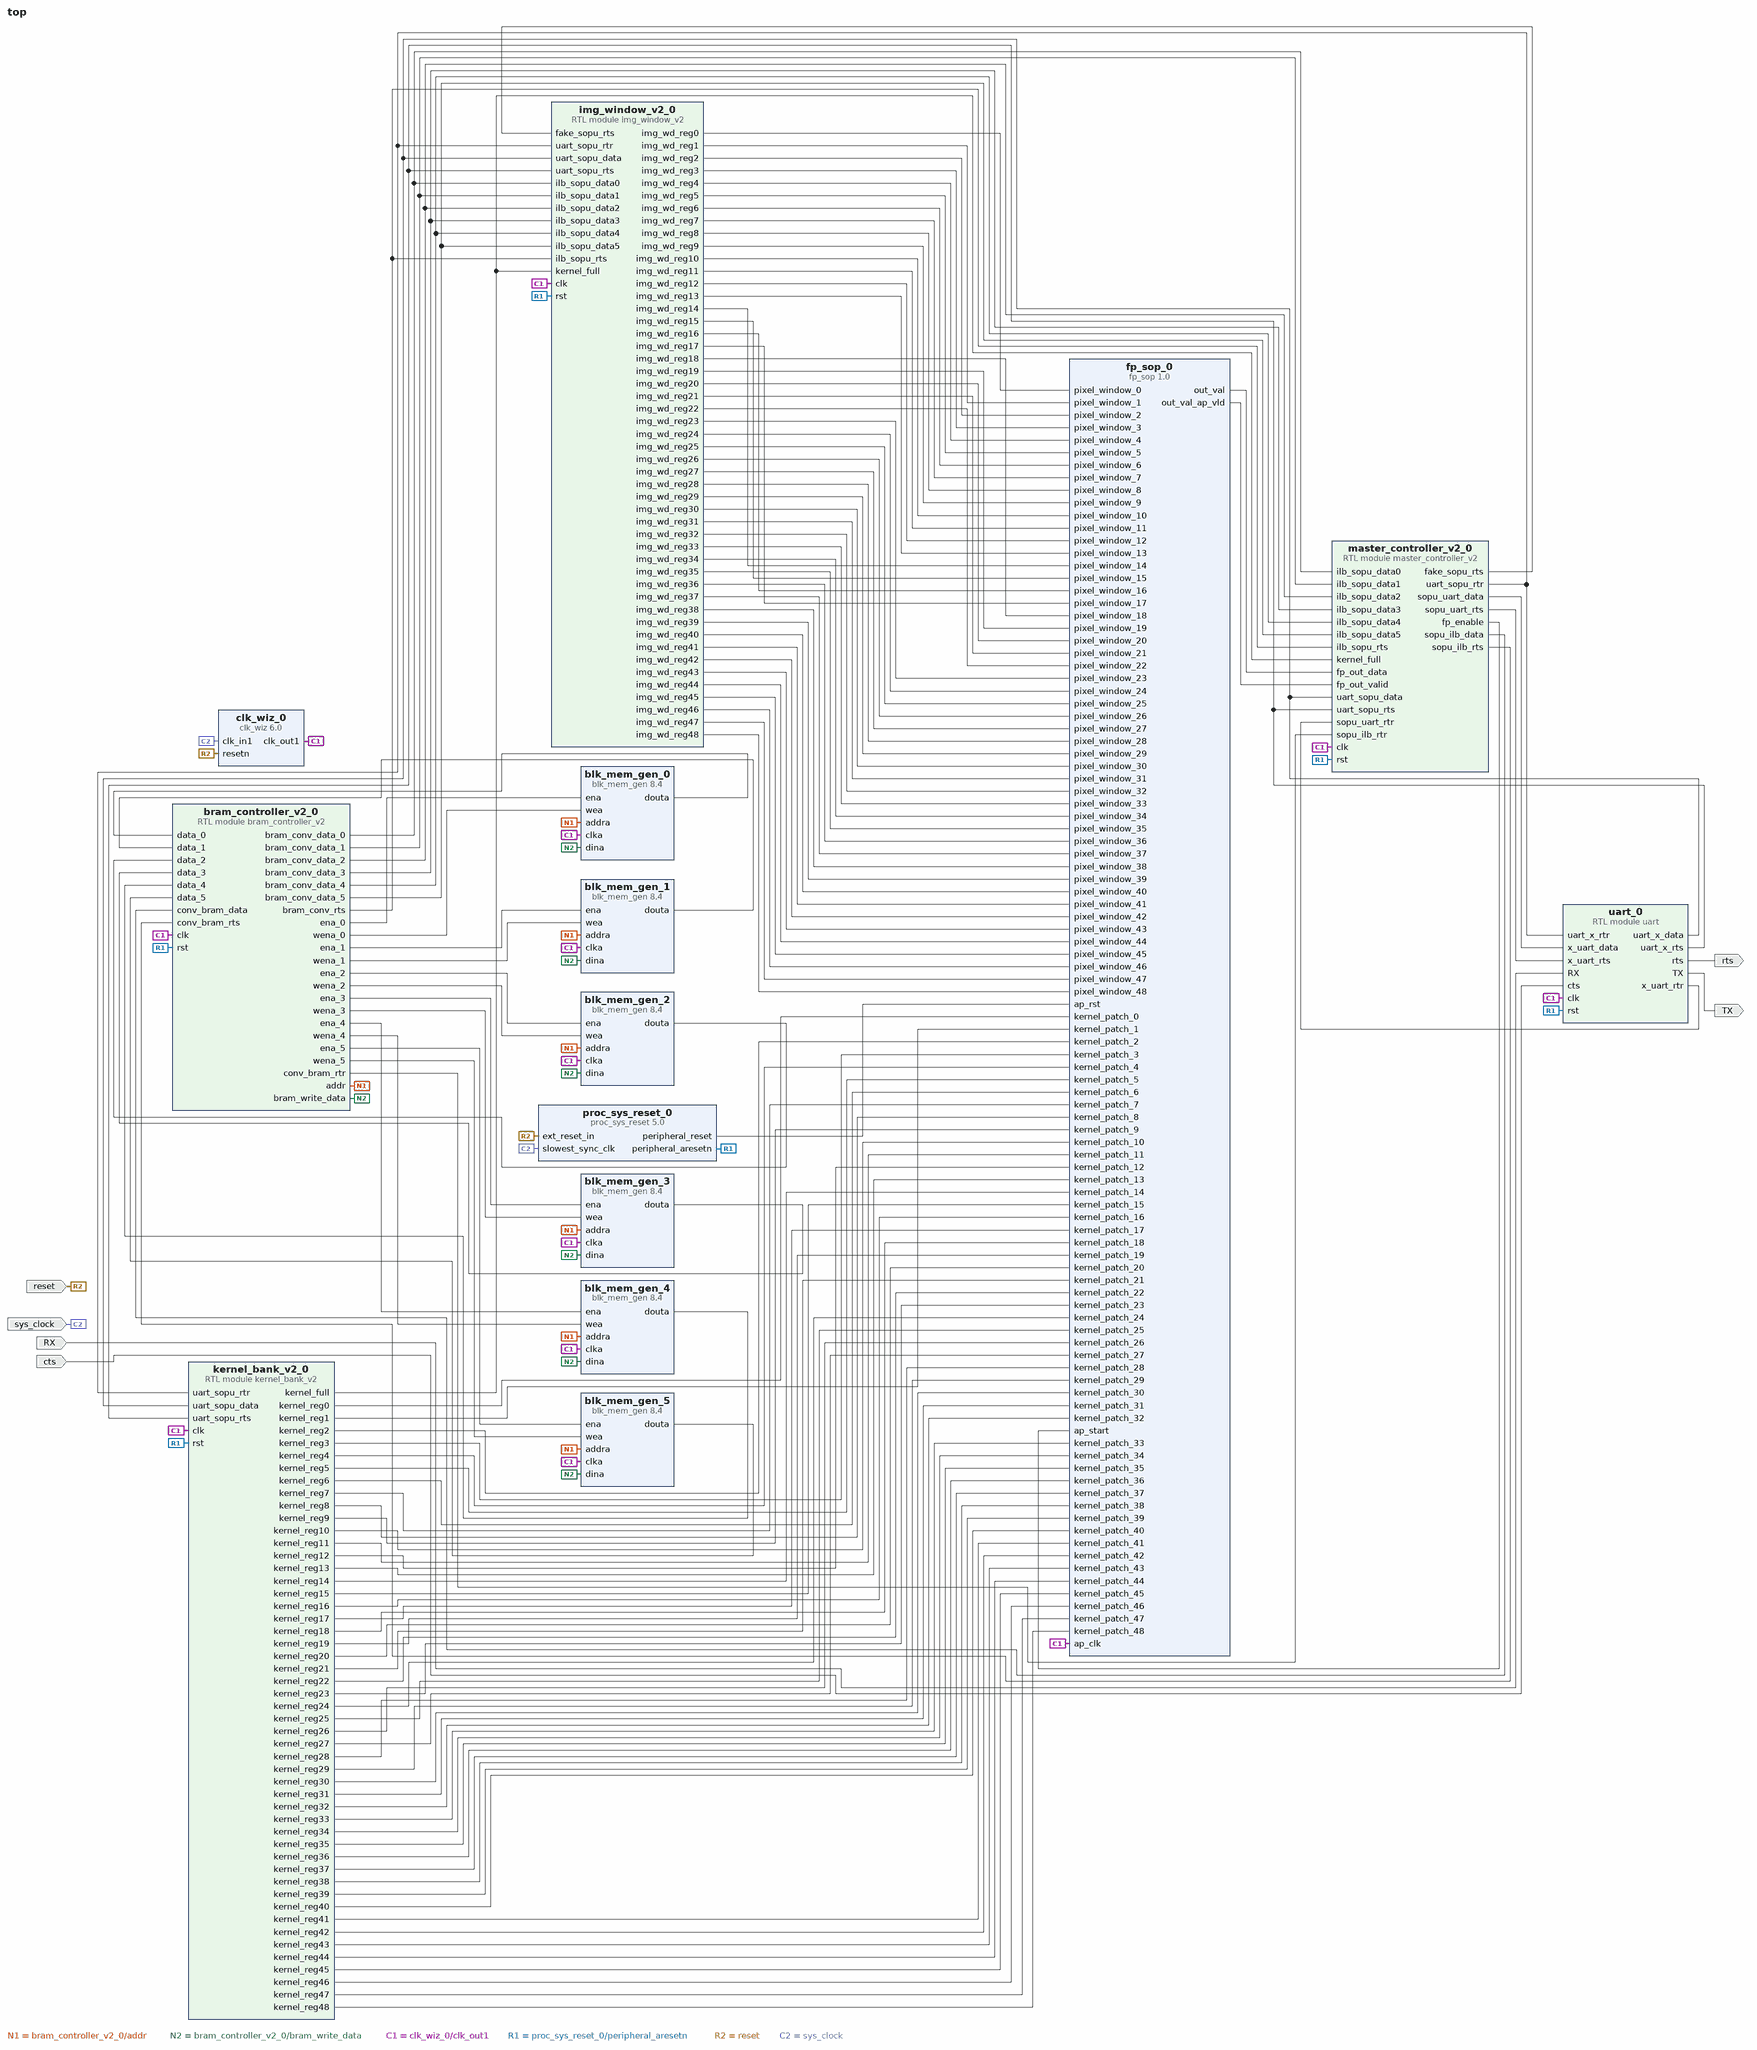
[diagram p0: block diagram of the top level]
# Vivado block design top, xc7a100tcsg324-1, Vivado 2019.2
create_bd_design top

create_bd_port -dir I RX
create_bd_port -dir O TX
create_bd_port -dir I cts
create_bd_port -dir I -type rst reset
create_bd_port -dir O rts
create_bd_port -dir I -type clk sys_clock
set_property -dict {CONFIG.FREQ_HZ 100000000} [get_bd_ports sys_clock]

create_bd_cell -type ip -vlnv xilinx.com:ip:blk_mem_gen:8.4 blk_mem_gen_0
set_property -dict [list \
  CONFIG.Enable_32bit_Address false \
  CONFIG.Fill_Remaining_Memory_Locations true \
  CONFIG.Operating_Mode_A READ_FIRST \
  CONFIG.Read_Width_A 8 \
  CONFIG.Register_PortA_Output_of_Memory_Primitives true \
  CONFIG.Use_Byte_Write_Enable false \
  CONFIG.Use_RSTA_Pin false \
  CONFIG.Write_Depth_A 518 \
  CONFIG.Write_Width_A 8 \
  CONFIG.use_bram_block Stand_Alone \
] [get_bd_cells blk_mem_gen_0]
create_bd_cell -type ip -vlnv xilinx.com:ip:blk_mem_gen:8.4 blk_mem_gen_1
set_property -dict [list \
  CONFIG.Enable_32bit_Address false \
  CONFIG.Fill_Remaining_Memory_Locations true \
  CONFIG.Operating_Mode_A READ_FIRST \
  CONFIG.Read_Width_A 8 \
  CONFIG.Register_PortA_Output_of_Memory_Primitives true \
  CONFIG.Use_Byte_Write_Enable false \
  CONFIG.Use_RSTA_Pin false \
  CONFIG.Write_Depth_A 518 \
  CONFIG.Write_Width_A 8 \
  CONFIG.use_bram_block Stand_Alone \
] [get_bd_cells blk_mem_gen_1]
create_bd_cell -type ip -vlnv xilinx.com:ip:blk_mem_gen:8.4 blk_mem_gen_2
set_property -dict [list \
  CONFIG.Enable_32bit_Address false \
  CONFIG.Fill_Remaining_Memory_Locations true \
  CONFIG.Operating_Mode_A READ_FIRST \
  CONFIG.Read_Width_A 8 \
  CONFIG.Register_PortA_Output_of_Memory_Primitives true \
  CONFIG.Use_Byte_Write_Enable false \
  CONFIG.Use_RSTA_Pin false \
  CONFIG.Write_Depth_A 518 \
  CONFIG.Write_Width_A 8 \
  CONFIG.use_bram_block Stand_Alone \
] [get_bd_cells blk_mem_gen_2]
create_bd_cell -type ip -vlnv xilinx.com:ip:blk_mem_gen:8.4 blk_mem_gen_3
set_property -dict [list \
  CONFIG.Enable_32bit_Address false \
  CONFIG.Fill_Remaining_Memory_Locations true \
  CONFIG.Operating_Mode_A READ_FIRST \
  CONFIG.Read_Width_A 8 \
  CONFIG.Register_PortA_Output_of_Memory_Primitives true \
  CONFIG.Use_Byte_Write_Enable false \
  CONFIG.Use_RSTA_Pin false \
  CONFIG.Write_Depth_A 518 \
  CONFIG.Write_Width_A 8 \
  CONFIG.use_bram_block Stand_Alone \
] [get_bd_cells blk_mem_gen_3]
create_bd_cell -type ip -vlnv xilinx.com:ip:blk_mem_gen:8.4 blk_mem_gen_4
set_property -dict [list \
  CONFIG.Enable_32bit_Address false \
  CONFIG.Fill_Remaining_Memory_Locations true \
  CONFIG.Operating_Mode_A READ_FIRST \
  CONFIG.Read_Width_A 8 \
  CONFIG.Register_PortA_Output_of_Memory_Primitives true \
  CONFIG.Use_Byte_Write_Enable false \
  CONFIG.Use_RSTA_Pin false \
  CONFIG.Write_Depth_A 518 \
  CONFIG.Write_Width_A 8 \
  CONFIG.use_bram_block Stand_Alone \
] [get_bd_cells blk_mem_gen_4]
create_bd_cell -type ip -vlnv xilinx.com:ip:blk_mem_gen:8.4 blk_mem_gen_5
set_property -dict [list \
  CONFIG.Enable_32bit_Address false \
  CONFIG.Fill_Remaining_Memory_Locations true \
  CONFIG.Operating_Mode_A READ_FIRST \
  CONFIG.Read_Width_A 8 \
  CONFIG.Register_PortA_Output_of_Memory_Primitives true \
  CONFIG.Use_Byte_Write_Enable false \
  CONFIG.Use_RSTA_Pin false \
  CONFIG.Write_Depth_A 518 \
  CONFIG.Write_Width_A 8 \
  CONFIG.use_bram_block Stand_Alone \
] [get_bd_cells blk_mem_gen_5]
create_bd_cell -type ip -vlnv xilinx.com:ip:clk_wiz:6.0 clk_wiz_0
set_property -dict {CONFIG.RESET_PORT resetn CONFIG.RESET_TYPE ACTIVE_LOW CONFIG.USE_LOCKED false} [get_bd_cells clk_wiz_0]
create_bd_cell -type ip -vlnv xilinx.com:hls:fp_sop:1.0 fp_sop_0
create_bd_cell -type module -reference img_window_v2 img_window_v2_0
create_bd_cell -type module -reference kernel_bank_v2 kernel_bank_v2_0
create_bd_cell -type ip -vlnv xilinx.com:ip:proc_sys_reset:5.0 proc_sys_reset_0
create_bd_cell -type module -reference bram_controller_v2 bram_controller_v2_0
create_bd_cell -type module -reference master_controller_v2 master_controller_v2_0
create_bd_cell -type module -reference uart uart_0

# ---- connections ----

connect_bd_net [get_bd_pins master_controller_v2_0/uart_sopu_rtr] \
  [get_bd_pins img_window_v2_0/uart_sopu_rtr] [get_bd_pins kernel_bank_v2_0/uart_sopu_rtr] [get_bd_pins uart_0/uart_x_rtr]
connect_bd_net [get_bd_ports RX] [get_bd_pins uart_0/RX]
connect_bd_net [get_bd_pins blk_mem_gen_0/douta] [get_bd_pins bram_controller_v2_0/data_0]
connect_bd_net [get_bd_pins blk_mem_gen_1/douta] [get_bd_pins bram_controller_v2_0/data_1]
connect_bd_net [get_bd_pins blk_mem_gen_2/douta] [get_bd_pins bram_controller_v2_0/data_2]
connect_bd_net [get_bd_pins blk_mem_gen_3/douta] [get_bd_pins bram_controller_v2_0/data_3]
connect_bd_net [get_bd_pins blk_mem_gen_4/douta] [get_bd_pins bram_controller_v2_0/data_4]
connect_bd_net [get_bd_pins blk_mem_gen_5/douta] [get_bd_pins bram_controller_v2_0/data_5]
connect_bd_net [get_bd_pins bram_controller_v2_0/addr] \
  [get_bd_pins blk_mem_gen_0/addra] [get_bd_pins blk_mem_gen_1/addra] [get_bd_pins blk_mem_gen_2/addra] \
  [get_bd_pins blk_mem_gen_3/addra] [get_bd_pins blk_mem_gen_4/addra] [get_bd_pins blk_mem_gen_5/addra]
connect_bd_net [get_bd_pins bram_controller_v2_0/bram_conv_data_0] \
  [get_bd_pins img_window_v2_0/ilb_sopu_data0] [get_bd_pins master_controller_v2_0/ilb_sopu_data0]
connect_bd_net [get_bd_pins bram_controller_v2_0/bram_conv_data_1] \
  [get_bd_pins img_window_v2_0/ilb_sopu_data1] [get_bd_pins master_controller_v2_0/ilb_sopu_data1]
connect_bd_net [get_bd_pins bram_controller_v2_0/bram_conv_data_2] \
  [get_bd_pins img_window_v2_0/ilb_sopu_data2] [get_bd_pins master_controller_v2_0/ilb_sopu_data2]
connect_bd_net [get_bd_pins bram_controller_v2_0/bram_conv_data_3] \
  [get_bd_pins img_window_v2_0/ilb_sopu_data3] [get_bd_pins master_controller_v2_0/ilb_sopu_data3]
connect_bd_net [get_bd_pins bram_controller_v2_0/bram_conv_data_4] \
  [get_bd_pins img_window_v2_0/ilb_sopu_data4] [get_bd_pins master_controller_v2_0/ilb_sopu_data4]
connect_bd_net [get_bd_pins bram_controller_v2_0/bram_conv_data_5] \
  [get_bd_pins img_window_v2_0/ilb_sopu_data5] [get_bd_pins master_controller_v2_0/ilb_sopu_data5]
connect_bd_net [get_bd_pins bram_controller_v2_0/bram_conv_rts] \
  [get_bd_pins img_window_v2_0/ilb_sopu_rts] [get_bd_pins master_controller_v2_0/ilb_sopu_rts]
connect_bd_net [get_bd_pins bram_controller_v2_0/bram_write_data] \
  [get_bd_pins blk_mem_gen_0/dina] [get_bd_pins blk_mem_gen_1/dina] [get_bd_pins blk_mem_gen_2/dina] \
  [get_bd_pins blk_mem_gen_3/dina] [get_bd_pins blk_mem_gen_4/dina] [get_bd_pins blk_mem_gen_5/dina]
connect_bd_net [get_bd_pins bram_controller_v2_0/conv_bram_rtr] [get_bd_pins master_controller_v2_0/sopu_ilb_rtr]
connect_bd_net [get_bd_pins bram_controller_v2_0/ena_0] [get_bd_pins blk_mem_gen_0/ena]
connect_bd_net [get_bd_pins bram_controller_v2_0/ena_1] [get_bd_pins blk_mem_gen_1/ena]
connect_bd_net [get_bd_pins bram_controller_v2_0/ena_2] [get_bd_pins blk_mem_gen_2/ena]
connect_bd_net [get_bd_pins bram_controller_v2_0/ena_3] [get_bd_pins blk_mem_gen_3/ena]
connect_bd_net [get_bd_pins bram_controller_v2_0/ena_4] [get_bd_pins blk_mem_gen_4/ena]
connect_bd_net [get_bd_pins bram_controller_v2_0/ena_5] [get_bd_pins blk_mem_gen_5/ena]
connect_bd_net [get_bd_pins bram_controller_v2_0/wena_0] [get_bd_pins blk_mem_gen_0/wea]
connect_bd_net [get_bd_pins bram_controller_v2_0/wena_1] [get_bd_pins blk_mem_gen_1/wea]
connect_bd_net [get_bd_pins bram_controller_v2_0/wena_2] [get_bd_pins blk_mem_gen_2/wea]
connect_bd_net [get_bd_pins bram_controller_v2_0/wena_3] [get_bd_pins blk_mem_gen_3/wea]
connect_bd_net [get_bd_pins bram_controller_v2_0/wena_4] [get_bd_pins blk_mem_gen_4/wea]
connect_bd_net [get_bd_pins bram_controller_v2_0/wena_5] [get_bd_pins blk_mem_gen_5/wea]
connect_bd_net -net clk_1 [get_bd_pins clk_wiz_0/clk_out1] \
  [get_bd_pins blk_mem_gen_0/clka] [get_bd_pins blk_mem_gen_1/clka] [get_bd_pins blk_mem_gen_2/clka] \
  [get_bd_pins blk_mem_gen_3/clka] [get_bd_pins blk_mem_gen_4/clka] [get_bd_pins blk_mem_gen_5/clka] \
  [get_bd_pins fp_sop_0/ap_clk] [get_bd_pins img_window_v2_0/clk] [get_bd_pins kernel_bank_v2_0/clk] \
  [get_bd_pins bram_controller_v2_0/clk] [get_bd_pins master_controller_v2_0/clk] [get_bd_pins uart_0/clk]
connect_bd_net [get_bd_ports cts] [get_bd_pins uart_0/cts]
connect_bd_net -net fp_sop_0_out_val_V [get_bd_pins fp_sop_0/out_val] [get_bd_pins master_controller_v2_0/fp_out_data]
connect_bd_net -net fp_sop_0_out_val_V_ap_vld [get_bd_pins fp_sop_0/out_val_ap_vld] [get_bd_pins master_controller_v2_0/fp_out_valid]
connect_bd_net [get_bd_pins img_window_v2_0/img_wd_reg0] [get_bd_pins fp_sop_0/pixel_window_0]
connect_bd_net [get_bd_pins img_window_v2_0/img_wd_reg1] [get_bd_pins fp_sop_0/pixel_window_1]
connect_bd_net [get_bd_pins img_window_v2_0/img_wd_reg2] [get_bd_pins fp_sop_0/pixel_window_2]
connect_bd_net [get_bd_pins img_window_v2_0/img_wd_reg3] [get_bd_pins fp_sop_0/pixel_window_3]
connect_bd_net [get_bd_pins img_window_v2_0/img_wd_reg4] [get_bd_pins fp_sop_0/pixel_window_4]
connect_bd_net [get_bd_pins img_window_v2_0/img_wd_reg5] [get_bd_pins fp_sop_0/pixel_window_5]
connect_bd_net [get_bd_pins img_window_v2_0/img_wd_reg6] [get_bd_pins fp_sop_0/pixel_window_6]
connect_bd_net [get_bd_pins img_window_v2_0/img_wd_reg7] [get_bd_pins fp_sop_0/pixel_window_7]
connect_bd_net [get_bd_pins img_window_v2_0/img_wd_reg8] [get_bd_pins fp_sop_0/pixel_window_8]
connect_bd_net [get_bd_pins img_window_v2_0/img_wd_reg9] [get_bd_pins fp_sop_0/pixel_window_9]
connect_bd_net [get_bd_pins img_window_v2_0/img_wd_reg10] [get_bd_pins fp_sop_0/pixel_window_10]
connect_bd_net [get_bd_pins img_window_v2_0/img_wd_reg11] [get_bd_pins fp_sop_0/pixel_window_11]
connect_bd_net [get_bd_pins img_window_v2_0/img_wd_reg12] [get_bd_pins fp_sop_0/pixel_window_12]
connect_bd_net [get_bd_pins img_window_v2_0/img_wd_reg13] [get_bd_pins fp_sop_0/pixel_window_13]
connect_bd_net [get_bd_pins img_window_v2_0/img_wd_reg14] [get_bd_pins fp_sop_0/pixel_window_14]
connect_bd_net [get_bd_pins img_window_v2_0/img_wd_reg15] [get_bd_pins fp_sop_0/pixel_window_15]
connect_bd_net [get_bd_pins img_window_v2_0/img_wd_reg16] [get_bd_pins fp_sop_0/pixel_window_16]
connect_bd_net [get_bd_pins img_window_v2_0/img_wd_reg17] [get_bd_pins fp_sop_0/pixel_window_17]
connect_bd_net [get_bd_pins img_window_v2_0/img_wd_reg18] [get_bd_pins fp_sop_0/pixel_window_18]
connect_bd_net [get_bd_pins img_window_v2_0/img_wd_reg19] [get_bd_pins fp_sop_0/pixel_window_19]
connect_bd_net [get_bd_pins img_window_v2_0/img_wd_reg20] [get_bd_pins fp_sop_0/pixel_window_20]
connect_bd_net [get_bd_pins img_window_v2_0/img_wd_reg21] [get_bd_pins fp_sop_0/pixel_window_21]
connect_bd_net [get_bd_pins img_window_v2_0/img_wd_reg22] [get_bd_pins fp_sop_0/pixel_window_22]
connect_bd_net [get_bd_pins img_window_v2_0/img_wd_reg23] [get_bd_pins fp_sop_0/pixel_window_23]
connect_bd_net [get_bd_pins img_window_v2_0/img_wd_reg24] [get_bd_pins fp_sop_0/pixel_window_24]
connect_bd_net [get_bd_pins img_window_v2_0/img_wd_reg25] [get_bd_pins fp_sop_0/pixel_window_25]
connect_bd_net [get_bd_pins img_window_v2_0/img_wd_reg26] [get_bd_pins fp_sop_0/pixel_window_26]
connect_bd_net [get_bd_pins img_window_v2_0/img_wd_reg27] [get_bd_pins fp_sop_0/pixel_window_27]
connect_bd_net [get_bd_pins img_window_v2_0/img_wd_reg28] [get_bd_pins fp_sop_0/pixel_window_28]
connect_bd_net [get_bd_pins img_window_v2_0/img_wd_reg29] [get_bd_pins fp_sop_0/pixel_window_29]
connect_bd_net [get_bd_pins img_window_v2_0/img_wd_reg30] [get_bd_pins fp_sop_0/pixel_window_30]
connect_bd_net [get_bd_pins img_window_v2_0/img_wd_reg31] [get_bd_pins fp_sop_0/pixel_window_31]
connect_bd_net [get_bd_pins img_window_v2_0/img_wd_reg32] [get_bd_pins fp_sop_0/pixel_window_32]
connect_bd_net [get_bd_pins img_window_v2_0/img_wd_reg33] [get_bd_pins fp_sop_0/pixel_window_33]
connect_bd_net [get_bd_pins img_window_v2_0/img_wd_reg34] [get_bd_pins fp_sop_0/pixel_window_34]
connect_bd_net [get_bd_pins img_window_v2_0/img_wd_reg35] [get_bd_pins fp_sop_0/pixel_window_35]
connect_bd_net [get_bd_pins img_window_v2_0/img_wd_reg36] [get_bd_pins fp_sop_0/pixel_window_36]
connect_bd_net [get_bd_pins img_window_v2_0/img_wd_reg37] [get_bd_pins fp_sop_0/pixel_window_37]
connect_bd_net [get_bd_pins img_window_v2_0/img_wd_reg38] [get_bd_pins fp_sop_0/pixel_window_38]
connect_bd_net [get_bd_pins img_window_v2_0/img_wd_reg39] [get_bd_pins fp_sop_0/pixel_window_39]
connect_bd_net [get_bd_pins img_window_v2_0/img_wd_reg40] [get_bd_pins fp_sop_0/pixel_window_40]
connect_bd_net [get_bd_pins img_window_v2_0/img_wd_reg41] [get_bd_pins fp_sop_0/pixel_window_41]
connect_bd_net [get_bd_pins img_window_v2_0/img_wd_reg42] [get_bd_pins fp_sop_0/pixel_window_42]
connect_bd_net [get_bd_pins img_window_v2_0/img_wd_reg43] [get_bd_pins fp_sop_0/pixel_window_43]
connect_bd_net [get_bd_pins img_window_v2_0/img_wd_reg44] [get_bd_pins fp_sop_0/pixel_window_44]
connect_bd_net [get_bd_pins img_window_v2_0/img_wd_reg45] [get_bd_pins fp_sop_0/pixel_window_45]
connect_bd_net [get_bd_pins img_window_v2_0/img_wd_reg46] [get_bd_pins fp_sop_0/pixel_window_46]
connect_bd_net [get_bd_pins img_window_v2_0/img_wd_reg47] [get_bd_pins fp_sop_0/pixel_window_47]
connect_bd_net [get_bd_pins img_window_v2_0/img_wd_reg48] [get_bd_pins fp_sop_0/pixel_window_48]
connect_bd_net [get_bd_pins kernel_bank_v2_0/kernel_full] [get_bd_pins img_window_v2_0/kernel_full] [get_bd_pins master_controller_v2_0/kernel_full]
connect_bd_net [get_bd_pins kernel_bank_v2_0/kernel_reg0] [get_bd_pins fp_sop_0/kernel_patch_0]
connect_bd_net [get_bd_pins kernel_bank_v2_0/kernel_reg1] [get_bd_pins fp_sop_0/kernel_patch_1]
connect_bd_net [get_bd_pins kernel_bank_v2_0/kernel_reg2] [get_bd_pins fp_sop_0/kernel_patch_2]
connect_bd_net [get_bd_pins kernel_bank_v2_0/kernel_reg3] [get_bd_pins fp_sop_0/kernel_patch_3]
connect_bd_net [get_bd_pins kernel_bank_v2_0/kernel_reg4] [get_bd_pins fp_sop_0/kernel_patch_4]
connect_bd_net [get_bd_pins kernel_bank_v2_0/kernel_reg5] [get_bd_pins fp_sop_0/kernel_patch_5]
connect_bd_net [get_bd_pins kernel_bank_v2_0/kernel_reg6] [get_bd_pins fp_sop_0/kernel_patch_6]
connect_bd_net [get_bd_pins kernel_bank_v2_0/kernel_reg7] [get_bd_pins fp_sop_0/kernel_patch_7]
connect_bd_net [get_bd_pins kernel_bank_v2_0/kernel_reg8] [get_bd_pins fp_sop_0/kernel_patch_8]
connect_bd_net [get_bd_pins kernel_bank_v2_0/kernel_reg9] [get_bd_pins fp_sop_0/kernel_patch_9]
connect_bd_net [get_bd_pins kernel_bank_v2_0/kernel_reg10] [get_bd_pins fp_sop_0/kernel_patch_10]
connect_bd_net [get_bd_pins kernel_bank_v2_0/kernel_reg11] [get_bd_pins fp_sop_0/kernel_patch_11]
connect_bd_net [get_bd_pins kernel_bank_v2_0/kernel_reg12] [get_bd_pins fp_sop_0/kernel_patch_12]
connect_bd_net [get_bd_pins kernel_bank_v2_0/kernel_reg13] [get_bd_pins fp_sop_0/kernel_patch_13]
connect_bd_net [get_bd_pins kernel_bank_v2_0/kernel_reg14] [get_bd_pins fp_sop_0/kernel_patch_14]
connect_bd_net [get_bd_pins kernel_bank_v2_0/kernel_reg15] [get_bd_pins fp_sop_0/kernel_patch_15]
connect_bd_net [get_bd_pins kernel_bank_v2_0/kernel_reg16] [get_bd_pins fp_sop_0/kernel_patch_16]
connect_bd_net [get_bd_pins kernel_bank_v2_0/kernel_reg17] [get_bd_pins fp_sop_0/kernel_patch_17]
connect_bd_net [get_bd_pins kernel_bank_v2_0/kernel_reg18] [get_bd_pins fp_sop_0/kernel_patch_18]
connect_bd_net [get_bd_pins kernel_bank_v2_0/kernel_reg19] [get_bd_pins fp_sop_0/kernel_patch_19]
connect_bd_net [get_bd_pins kernel_bank_v2_0/kernel_reg20] [get_bd_pins fp_sop_0/kernel_patch_20]
connect_bd_net [get_bd_pins kernel_bank_v2_0/kernel_reg21] [get_bd_pins fp_sop_0/kernel_patch_21]
connect_bd_net [get_bd_pins kernel_bank_v2_0/kernel_reg22] [get_bd_pins fp_sop_0/kernel_patch_22]
connect_bd_net [get_bd_pins kernel_bank_v2_0/kernel_reg23] [get_bd_pins fp_sop_0/kernel_patch_23]
connect_bd_net [get_bd_pins kernel_bank_v2_0/kernel_reg24] [get_bd_pins fp_sop_0/kernel_patch_24]
connect_bd_net [get_bd_pins kernel_bank_v2_0/kernel_reg25] [get_bd_pins fp_sop_0/kernel_patch_25]
connect_bd_net [get_bd_pins kernel_bank_v2_0/kernel_reg26] [get_bd_pins fp_sop_0/kernel_patch_26]
connect_bd_net [get_bd_pins kernel_bank_v2_0/kernel_reg27] [get_bd_pins fp_sop_0/kernel_patch_27]
connect_bd_net [get_bd_pins kernel_bank_v2_0/kernel_reg28] [get_bd_pins fp_sop_0/kernel_patch_28]
connect_bd_net [get_bd_pins kernel_bank_v2_0/kernel_reg29] [get_bd_pins fp_sop_0/kernel_patch_29]
connect_bd_net [get_bd_pins kernel_bank_v2_0/kernel_reg30] [get_bd_pins fp_sop_0/kernel_patch_30]
connect_bd_net [get_bd_pins kernel_bank_v2_0/kernel_reg31] [get_bd_pins fp_sop_0/kernel_patch_31]
connect_bd_net [get_bd_pins kernel_bank_v2_0/kernel_reg32] [get_bd_pins fp_sop_0/kernel_patch_32]
connect_bd_net [get_bd_pins kernel_bank_v2_0/kernel_reg33] [get_bd_pins fp_sop_0/kernel_patch_33]
connect_bd_net [get_bd_pins kernel_bank_v2_0/kernel_reg34] [get_bd_pins fp_sop_0/kernel_patch_34]
connect_bd_net [get_bd_pins kernel_bank_v2_0/kernel_reg35] [get_bd_pins fp_sop_0/kernel_patch_35]
connect_bd_net [get_bd_pins kernel_bank_v2_0/kernel_reg36] [get_bd_pins fp_sop_0/kernel_patch_36]
connect_bd_net [get_bd_pins kernel_bank_v2_0/kernel_reg37] [get_bd_pins fp_sop_0/kernel_patch_37]
connect_bd_net [get_bd_pins kernel_bank_v2_0/kernel_reg38] [get_bd_pins fp_sop_0/kernel_patch_38]
connect_bd_net [get_bd_pins kernel_bank_v2_0/kernel_reg39] [get_bd_pins fp_sop_0/kernel_patch_39]
connect_bd_net [get_bd_pins kernel_bank_v2_0/kernel_reg40] [get_bd_pins fp_sop_0/kernel_patch_40]
connect_bd_net [get_bd_pins kernel_bank_v2_0/kernel_reg41] [get_bd_pins fp_sop_0/kernel_patch_41]
connect_bd_net [get_bd_pins kernel_bank_v2_0/kernel_reg42] [get_bd_pins fp_sop_0/kernel_patch_42]
connect_bd_net [get_bd_pins kernel_bank_v2_0/kernel_reg43] [get_bd_pins fp_sop_0/kernel_patch_43]
connect_bd_net [get_bd_pins kernel_bank_v2_0/kernel_reg44] [get_bd_pins fp_sop_0/kernel_patch_44]
connect_bd_net [get_bd_pins kernel_bank_v2_0/kernel_reg45] [get_bd_pins fp_sop_0/kernel_patch_45]
connect_bd_net [get_bd_pins kernel_bank_v2_0/kernel_reg46] [get_bd_pins fp_sop_0/kernel_patch_46]
connect_bd_net [get_bd_pins kernel_bank_v2_0/kernel_reg47] [get_bd_pins fp_sop_0/kernel_patch_47]
connect_bd_net [get_bd_pins kernel_bank_v2_0/kernel_reg48] [get_bd_pins fp_sop_0/kernel_patch_48]
connect_bd_net [get_bd_pins master_controller_v2_0/fake_sopu_rts] [get_bd_pins img_window_v2_0/fake_sopu_rts]
connect_bd_net [get_bd_pins master_controller_v2_0/fp_enable] [get_bd_pins fp_sop_0/ap_start]
connect_bd_net [get_bd_pins master_controller_v2_0/sopu_ilb_data] [get_bd_pins bram_controller_v2_0/conv_bram_data]
connect_bd_net [get_bd_pins master_controller_v2_0/sopu_ilb_rts] [get_bd_pins bram_controller_v2_0/conv_bram_rts]
connect_bd_net [get_bd_pins master_controller_v2_0/sopu_uart_data] [get_bd_pins uart_0/x_uart_data]
connect_bd_net [get_bd_pins master_controller_v2_0/sopu_uart_rts] [get_bd_pins uart_0/x_uart_rts]
connect_bd_net [get_bd_pins proc_sys_reset_0/peripheral_aresetn] \
  [get_bd_pins img_window_v2_0/rst] [get_bd_pins kernel_bank_v2_0/rst] [get_bd_pins bram_controller_v2_0/rst] \
  [get_bd_pins master_controller_v2_0/rst] [get_bd_pins uart_0/rst]
connect_bd_net [get_bd_pins proc_sys_reset_0/peripheral_reset] [get_bd_pins fp_sop_0/ap_rst]
connect_bd_net [get_bd_ports reset] [get_bd_pins clk_wiz_0/resetn] [get_bd_pins proc_sys_reset_0/ext_reset_in]
connect_bd_net [get_bd_ports sys_clock] [get_bd_pins clk_wiz_0/clk_in1] [get_bd_pins proc_sys_reset_0/slowest_sync_clk]
connect_bd_net [get_bd_pins uart_0/TX] [get_bd_ports TX]
connect_bd_net [get_bd_pins uart_0/rts] [get_bd_ports rts]
connect_bd_net [get_bd_pins uart_0/uart_x_data] \
  [get_bd_pins img_window_v2_0/uart_sopu_data] [get_bd_pins kernel_bank_v2_0/uart_sopu_data] \
  [get_bd_pins master_controller_v2_0/uart_sopu_data]
connect_bd_net [get_bd_pins uart_0/uart_x_rts] \
  [get_bd_pins img_window_v2_0/uart_sopu_rts] [get_bd_pins kernel_bank_v2_0/uart_sopu_rts] \
  [get_bd_pins master_controller_v2_0/uart_sopu_rts]
connect_bd_net [get_bd_pins uart_0/x_uart_rtr] [get_bd_pins master_controller_v2_0/sopu_uart_rtr]

validate_bd_design
save_bd_design
